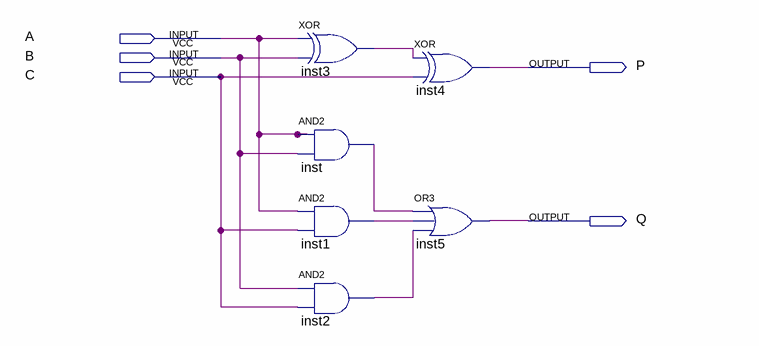
[diagram p0: schematic sheet]
// Quartus schematic FullAdder.bdf as structural Verilog: 6 symbols, 5 pins
module FullAdder (
  input  A,
  input  B,
  input  C,
  output P,
  output Q
);

  wire inst1_out, inst2_out, inst3_out, inst_out;

  xor inst3 (inst3_out, A, B);
  and inst (inst_out, A, B);
  and inst1 (inst1_out, A, C);
  and inst2 (inst2_out, B, C);
  xor inst4 (P, inst3_out, C);
  or inst5 (Q, inst_out, inst1_out, inst2_out);
endmodule
